# Altium schematic sheet 1 - Power.SchDoc
size A4
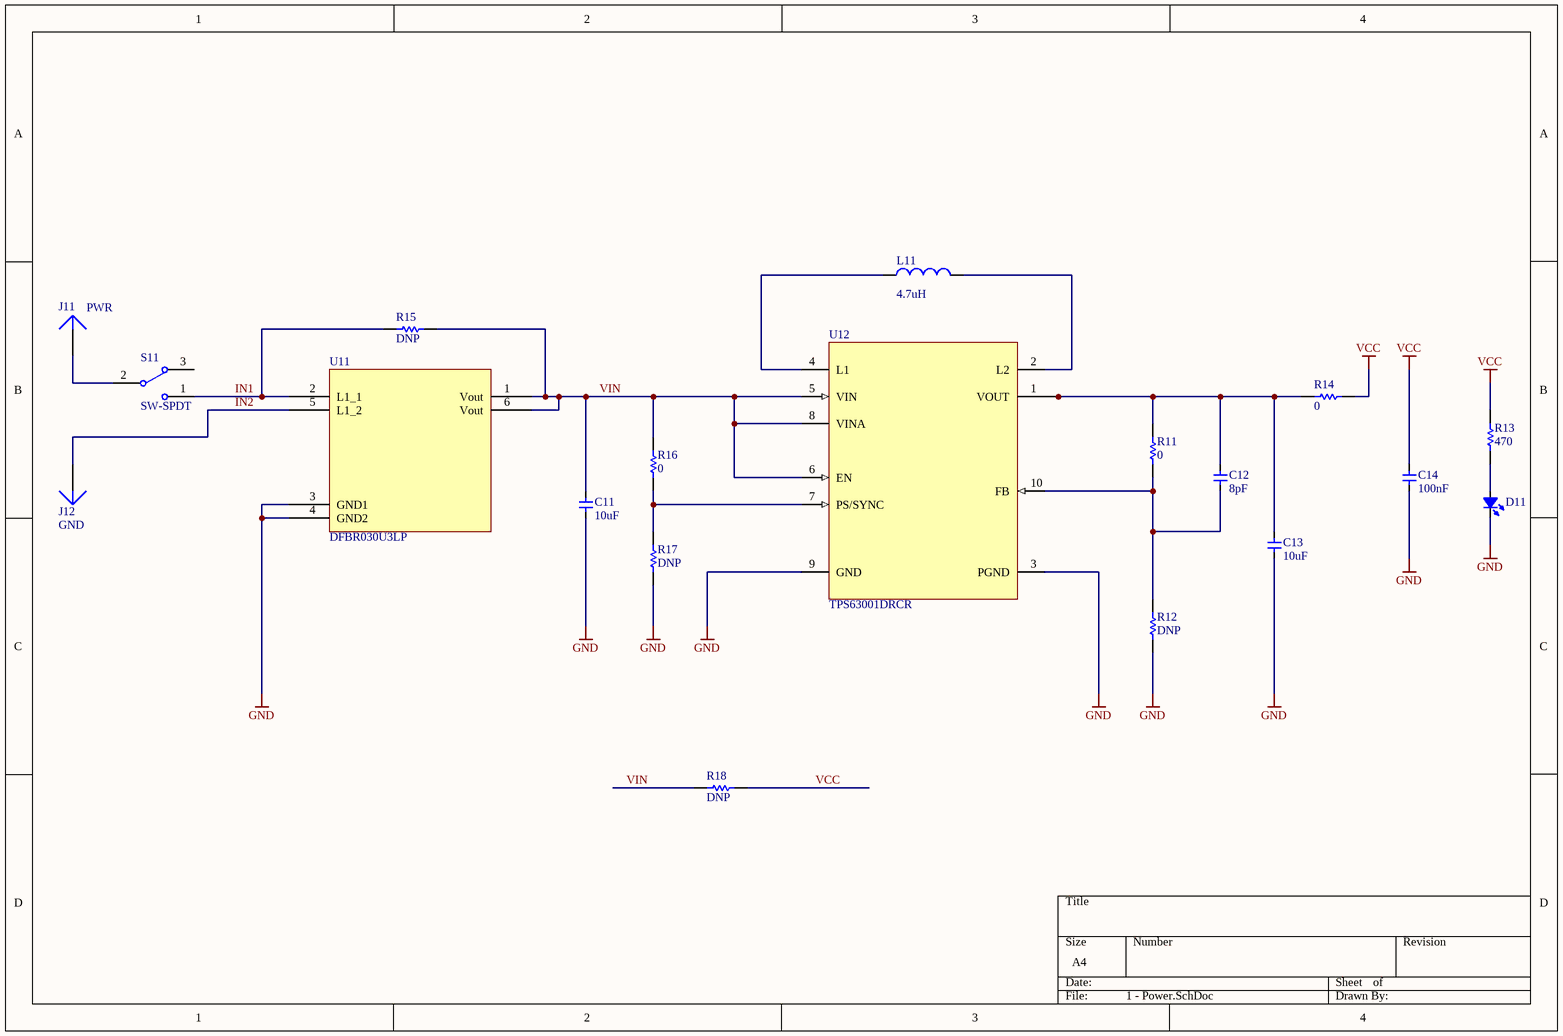
[diagram p0: 1 - Power.SchDoc]

## Parts
C11  value 10uF  [CAPC2012X135N]  (hidden comment: Cap_0603)
C12  value 8pF  [CAP_0603]  (hidden comment: Cap_0603)
C13  value 10uF  [CAPC2012X135N]  (hidden comment: Cap_0603)
C14  value 100nF  [CAP_0603]  (hidden comment: Cap_0603)
D11  LED_0603  [LED_0603_RED]  (value not drawn)
J11  PWR  [PIN1]
J12  GND  [PIN1]
L11  value 4.7uH  [RES_0805]  (hidden comment: Inductor)
R11  value 0  [RES_0603]  (hidden comment: Res1)
R12  value DNP  [RES_0603]  (hidden comment: Res1)
R13  value 470  [RES_0603]  (hidden comment: Res1)
R14  value 0  [RES_0603]  (hidden comment: Res1)
R15  value DNP  [RES_0603]  (hidden comment: Res1)
R16  value 0  [RES_0603]  (hidden comment: Res1)
R17  value DNP  [RES_0603]  (hidden comment: Res1)
R18  value DNP  [RES_0603]  (hidden comment: Res1)
S11  SW-SPDT  [MSK-12C02]
U11  DFBR030U3LP  [U-DFN4040-8]
U12  TPS63001DRCR  [10-VSON]

## Nets
GND: C11.1 C13.1 C14.1 D11.2(K) R12.1 R17.1 U11.3(GND1) U11.4(GND2) U12.3(PGND) U12.9(GND)
VCC: C14.2 R13.2 R14.1 R18.1
IN1: R15.2 S11.1 U11.2(L1_1)
IN2: J12.1 U11.5(L1_2)
VIN: C11.2 R15.1 R16.2 R18.2 U11.1(Vout) U11.6(Vout) U12.5(VIN) U12.6(EN) U12.8(VINA)
NetC12_1: C12.1 R11.1 R12.2 U12.10(FB)
NetC12_2: C12.2 C13.2 R11.2 R14.2 U12.1(VOUT)
NetD11_1: D11.1(A) R13.1
NetJ11_1: J11.1 S11.2
NetL11_1: L11.1 U12.4(L1)
NetL11_2: L11.2 U12.2(L2)
NetR16_1: R16.1 R17.2 U12.7(PS/SYNC)

Not connected (* = marked no-connect by the designer): S11 3

## Library data of the parts
C11-C14 = Cap_0603: Capacitor
D11 = LED_0603: LED
J11 J12 = Plug: LatestRevisionDate: 17-Jul-2002; LatestRevisionNote: Re-released for DXP Platform.; Publisher: Altium Limited
L11 = Inductor: Code_IEC: 2012; Published: 8-Jun-2000; LatestRevisionDate: 29-May-2009; LatestRevisionNote: IPC-7351 Footprint Added.; PackageReference: 0402-A; Publisher: Altium Limited; PackageDescription: Chip Inductor; Code_JEITA: 0805
R11-R18 = Res1: Resistor; Published: 8-Jun-2000; LatestRevisionDate: 17-Jul-2002; LatestRevisionNote: Re-released for DXP Platform.; PackageReference: AXIAL-0.3; Publisher: Altium Limited; PackageDescription: Axial Device, Thru-Hole; 2 Leads; 0.3 in Pin Spacing
S11 = SW-SPDT: SPDT Subminiature Toggle Switch, Right Angle Mounting, Vertical Actuation; Published: 24-Mar-1999; LatestRevisionDate: 17-Dec-2003; LatestRevisionNote: Schematic revised, PCB Footprint replaced.; DatasheetVersion: 05-Dec-2000; PackageReference: TL36WW15050; Publisher: Altium Limited; PackageDescription: Switch; 4 Leads; ComponentLink1Description: Manufacturer Link; ComponentLink1URL: http://www.apem.com
U11 = DFBR030U3LP: 3A Full Bridge Rectifier
U12 = TPS63001DRCR: Buck-Boost Switching Regulator IC Positive Fixed 3.3V 1 Output 1.6A (Switch) 10-VFDFN Exposed Pad; PackageReference: 10-VSON (3x3); PackageDescription: 10-VFDFN Exposed Pad; Supplier 1: Digi-Key; Supplier Part Number 1: 296-19643-1-ND; ComponentLink1Description: Datasheet; ComponentLink1URL: http://www.ti.com/lit/ds/symlink/tps63001.pdf; ComponentLink2Description: Packaging Specification